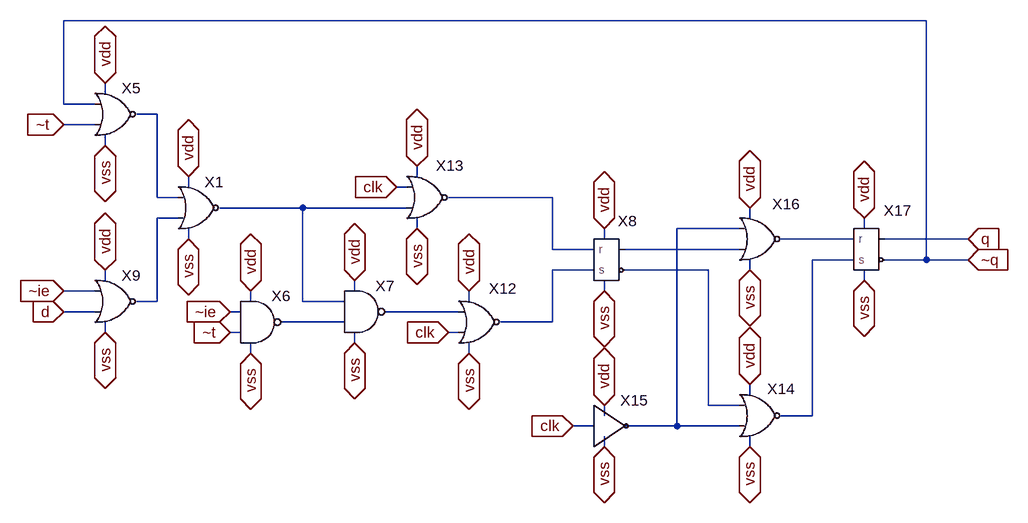
[diagram p0: schematic dt_flip_flop.asc]
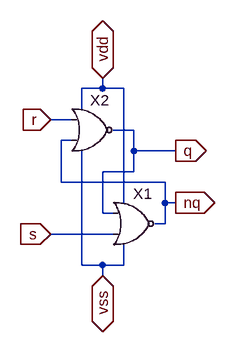
[diagram p1: sub-circuit sr_latch.asc]
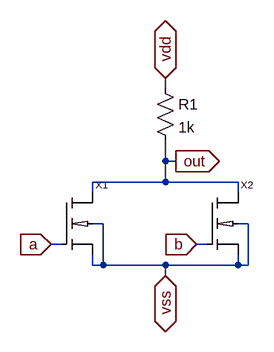
[diagram p2: sub-circuit nor.asc]
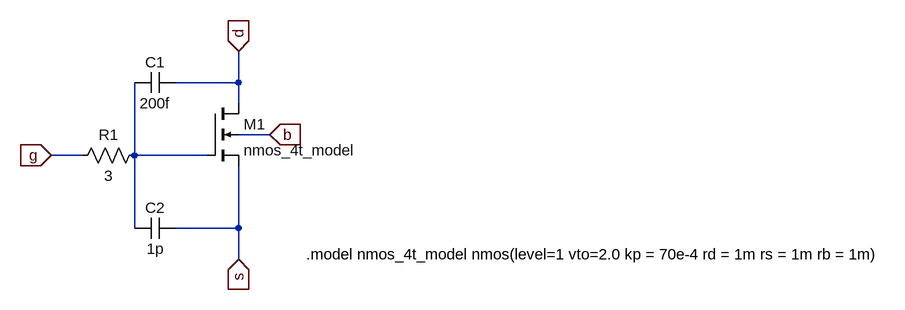
[diagram p3: sub-circuit nmos_4t.asc]
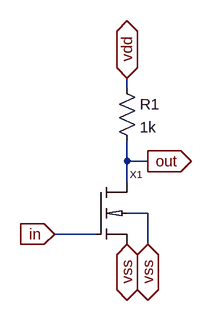
[diagram p4: sub-circuit not.asc]
dt_flip_flop.asc, the LTspice schematic file:
Version 4
SHEET 1 1928 1824
WIRE 1184 -16 -144 -16
WIRE -80 96 -80 80
WIRE -144 112 -144 -16
WIRE -96 112 -144 112
WIRE 0 128 -32 128
WIRE -96 144 -144 144
WIRE -80 176 -80 160
WIRE 400 224 400 208
WIRE 48 240 48 224
WIRE 384 240 368 240
WIRE 0 256 0 128
WIRE 32 256 0 256
WIRE 608 256 448 256
WIRE 224 272 96 272
WIRE 384 272 224 272
WIRE 32 288 0 288
WIRE 912 288 912 272
WIRE 400 304 400 288
WIRE 896 304 800 304
WIRE 1088 304 1088 288
WIRE 48 320 48 304
WIRE 688 320 688 304
WIRE 1072 320 960 320
WIRE 1248 320 1120 320
WIRE 608 336 608 256
WIRE 672 336 608 336
WIRE 896 336 720 336
WIRE 1072 352 1008 352
WIRE 1184 352 1184 -16
WIRE 1184 352 1120 352
WIRE 1248 352 1184 352
WIRE 672 368 608 368
WIRE 848 368 720 368
WIRE 912 368 912 352
WIRE -80 384 -80 368
WIRE 1088 384 1088 368
WIRE -96 400 -144 400
WIRE 304 400 304 384
WIRE 688 400 688 384
WIRE 0 416 0 288
WIRE 0 416 -32 416
WIRE 144 416 144 400
WIRE 224 416 224 272
WIRE 288 416 224 416
WIRE 480 416 480 400
WIRE -96 432 -144 432
WIRE 128 432 112 432
WIRE 464 432 352 432
WIRE 288 448 192 448
WIRE 608 448 608 368
WIRE 608 448 528 448
WIRE -80 464 -80 448
WIRE 128 464 112 464
WIRE 464 464 448 464
WIRE 304 480 304 464
WIRE 144 496 144 480
WIRE 480 496 480 480
WIRE 912 560 912 544
WIRE 848 576 848 368
WIRE 896 576 848 576
WIRE 688 592 688 576
WIRE 1008 592 1008 352
WIRE 1008 592 960 592
WIRE 672 608 640 608
WIRE 800 608 800 304
WIRE 800 608 720 608
WIRE 896 608 800 608
WIRE 688 640 688 624
WIRE 912 640 912 624
FLAG 112 432 ~ie
IOPIN 112 432 In
FLAG 112 464 ~t
IOPIN 112 464 In
FLAG 448 464 clk
IOPIN 448 464 In
FLAG 368 240 clk
IOPIN 368 240 In
FLAG 640 608 clk
IOPIN 640 608 In
FLAG 400 208 vdd
IOPIN 400 208 BiDir
FLAG 480 400 vdd
IOPIN 480 400 BiDir
FLAG 688 304 vdd
IOPIN 688 304 BiDir
FLAG 912 272 vdd
IOPIN 912 272 BiDir
FLAG 1088 288 vdd
IOPIN 1088 288 BiDir
FLAG 912 544 vdd
IOPIN 912 544 BiDir
FLAG 688 576 vdd
IOPIN 688 576 BiDir
FLAG 304 384 vdd
IOPIN 304 384 BiDir
FLAG 144 400 vdd
IOPIN 144 400 BiDir
FLAG 304 480 vss
IOPIN 304 480 BiDir
FLAG 144 496 vss
IOPIN 144 496 BiDir
FLAG 480 496 vss
IOPIN 480 496 BiDir
FLAG 688 400 vss
IOPIN 688 400 BiDir
FLAG 688 640 vss
IOPIN 688 640 BiDir
FLAG 912 640 vss
IOPIN 912 640 BiDir
FLAG 912 368 vss
IOPIN 912 368 BiDir
FLAG 1088 384 vss
IOPIN 1088 384 BiDir
FLAG 400 304 vss
IOPIN 400 304 BiDir
FLAG 1248 320 q
IOPIN 1248 320 In
FLAG 1248 352 ~q
IOPIN 1248 352 In
FLAG -144 432 d
IOPIN -144 432 In
FLAG -144 144 ~t
IOPIN -144 144 In
FLAG 48 224 vdd
IOPIN 48 224 BiDir
FLAG -80 80 vdd
IOPIN -80 80 BiDir
FLAG -80 368 vdd
IOPIN -80 368 BiDir
FLAG -80 176 vss
IOPIN -80 176 BiDir
FLAG -80 464 vss
IOPIN -80 464 BiDir
FLAG 48 320 vss
IOPIN 48 320 BiDir
FLAG -144 400 ~ie
IOPIN -144 400 In
SYMBOL sr_latch 704 352 R0
WINDOW 0 20 -44 Bottom 2
SYMATTR InstName X8
SYMBOL nor 496 384 R0
WINDOW 0 15 12 Left 2
SYMATTR InstName X12
SYMBOL nor 416 192 R0
WINDOW 0 13 15 Left 2
SYMATTR InstName X13
SYMBOL not 672 608 R0
WINDOW 0 62 -24 Bottom 2
SYMATTR InstName X15
SYMBOL nor 928 528 R0
WINDOW 0 11 23 Left 2
SYMATTR InstName X14
SYMBOL nor 928 256 R0
WINDOW 0 19 10 Left 2
SYMATTR InstName X16
SYMBOL sr_latch 1104 336 R0
WINDOW 0 36 -44 Bottom 2
SYMATTR InstName X17
SYMBOL nor 64 208 R0
WINDOW 0 9 24 Left 2
SYMATTR InstName X1
SYMBOL nor -64 64 R0
WINDOW 0 9 24 Left 2
SYMATTR InstName X5
SYMBOL nor -64 352 R0
WINDOW 0 9 24 Left 2
SYMATTR InstName X9
SYMBOL nand 160 384 R0
SYMATTR InstName X6
SYMBOL nand 320 368 R0
SYMATTR InstName X7

sr_latch.asc, the sub-circuit schematic file:
Version 4
SHEET 1 880 680
WIRE 208 0 208 -16
WIRE 208 0 176 0
WIRE 240 0 208 0
WIRE 176 32 176 0
WIRE 160 48 128 48
WIRE 256 64 224 64
WIRE 160 80 144 80
WIRE 256 96 256 64
WIRE 320 96 256 96
WIRE 256 128 256 96
WIRE 256 128 208 128
WIRE 144 144 144 80
WIRE 304 144 144 144
WIRE 240 176 240 0
WIRE 304 176 304 144
WIRE 320 176 304 176
WIRE 208 192 208 128
WIRE 224 192 208 192
WIRE 304 208 304 176
WIRE 304 208 288 208
WIRE 224 224 128 224
WIRE 176 272 176 96
WIRE 208 272 176 272
WIRE 240 272 240 240
WIRE 240 272 208 272
WIRE 208 288 208 272
FLAG 128 224 s
IOPIN 128 224 In
FLAG 128 48 r
IOPIN 128 48 In
FLAG 320 96 q
IOPIN 320 96 Out
FLAG 320 176 nq
IOPIN 320 176 Out
FLAG 208 288 vss
IOPIN 208 288 BiDir
FLAG 208 -16 vdd
IOPIN 208 -16 BiDir
SYMBOL nor 256 144 R0
WINDOW 0 -1 18 Left 2
SYMATTR InstName X1
SYMBOL nor 192 0 R0
WINDOW 0 -3 18 Left 2
SYMATTR InstName X2

nor.asc, the sub-circuit schematic file:
Version 4
SHEET 1 880 680
WIRE 240 48 240 32
WIRE 240 160 240 128
WIRE 256 160 240 160
WIRE 240 192 240 160
WIRE 240 192 128 192
WIRE 352 192 240 192
WIRE 128 208 128 192
WIRE 352 208 352 192
WIRE 144 256 128 256
WIRE 368 256 352 256
WIRE 80 288 64 288
WIRE 304 288 288 288
WIRE 128 320 128 304
WIRE 144 320 144 256
WIRE 144 320 128 320
WIRE 240 320 144 320
WIRE 352 320 352 304
WIRE 352 320 240 320
WIRE 368 320 368 256
WIRE 368 320 352 320
WIRE 240 336 240 320
FLAG 240 32 vdd
IOPIN 240 32 BiDir
FLAG 240 336 vss
IOPIN 240 336 BiDir
FLAG 256 160 out
IOPIN 256 160 Out
FLAG 288 288 b
IOPIN 288 288 In
FLAG 64 288 a
IOPIN 64 288 In
SYMBOL res 224 32 R0
SYMATTR InstName R1
SYMATTR Value 1k
SYMBOL nmos_4t 80 208 R0
SYMATTR InstName X1
SYMBOL nmos_4t 304 208 R0
SYMATTR InstName X2

nmos_4t.asc, the sub-circuit schematic file:
Version 4
SHEET 1 880 680
WIRE -288 -224 -288 -272
WIRE -288 -224 -384 -224
WIRE -288 -192 -288 -224
WIRE -240 -144 -288 -144
WIRE -528 -112 -576 -112
WIRE -448 -112 -448 -224
WIRE -336 -112 -448 -112
WIRE -448 0 -448 -112
WIRE -288 0 -288 -96
WIRE -288 0 -384 0
WIRE -288 48 -288 0
FLAG -576 -112 g
IOPIN -576 -112 In
FLAG -288 -272 d
IOPIN -288 -272 In
FLAG -288 48 s
IOPIN -288 48 In
FLAG -240 -144 b
IOPIN -240 -144 In
SYMBOL nmos4 -336 -192 R0
SYMATTR InstName M1
SYMATTR Value nmos_4t_model
SYMBOL cap -384 -240 R90
WINDOW 0 0 32 VBottom 2
WINDOW 3 32 32 VTop 2
SYMATTR InstName C1
SYMATTR Value 200f
SYMBOL cap -384 -16 R90
WINDOW 0 0 32 VBottom 2
WINDOW 3 32 32 VTop 2
SYMATTR InstName C2
SYMATTR Value 1p
SYMBOL res -432 -128 R90
WINDOW 0 0 56 VBottom 2
WINDOW 3 32 56 VTop 2
SYMATTR InstName R1
SYMATTR Value 3
TEXT -184 40 Left 2 !.model nmos_4t_model nmos(level=1 vto=2.0 kp = 70e-4 rd = 1m rs = 1m rb = 1m)

not.asc, the sub-circuit schematic file:
Version 4
SHEET 1 880 680
WIRE 176 -96 176 -112
WIRE 176 16 176 -16
WIRE 208 16 176 16
WIRE 176 48 176 16
WIRE 208 96 176 96
WIRE 128 128 64 128
WIRE 208 144 208 96
FLAG 64 128 in
IOPIN 64 128 In
FLAG 176 144 vss
IOPIN 176 144 BiDir
FLAG 176 -112 vdd
IOPIN 176 -112 BiDir
FLAG 208 16 out
IOPIN 208 16 Out
FLAG 208 144 vss
IOPIN 208 144 BiDir
SYMBOL res 160 -112 R0
SYMATTR InstName R1
SYMATTR Value 1k
SYMBOL nmos_4t 128 48 R0
SYMATTR InstName X1

The netlist it stands for:
* dt_flip_flop.asc
XX8 N002 N009 N010 N007 vdd vss sr_latch
XX12 N011 clk vdd vss N009 nor
XX13 clk N003 vdd vss N002 nor
XX15 clk N005 vss vdd not
XX14 N010 N005 vdd vss N008 nor
XX16 N005 N007 vdd vss N006 nor
XX17 N006 N008 ~q q vdd vss sr_latch
XX1 N001 N004 vdd vss N003 nor
XX5 ~q ~t vdd vss N001 nor
XX9 ~ie d vdd vss N004 nor
XX6 ~ie ~t vdd vss N012 nand  ; pins a b vdd vss out
XX7 N003 N012 vdd vss N011 nand  ; pins a b vdd vss out

* block symbol definitions
.subckt sr_latch r s nq q vdd vss
XX1 q s vdd vss nq nor
XX2 r nq vdd vss q nor
.ends sr_latch

.subckt nor a b vdd vss out
R1 vdd out 1k
XX1 out a vss vss nmos_4t
XX2 out b vss vss nmos_4t
.ends nor

.subckt nmos_4t D G S B
M1 d N001 s b nmos_4t_model
C1 d N001 200f
C2 s N001 1p
R1 N001 g 3
.model nmos_4t_model nmos(level=1 vto=2.0 kp = 70e-4 rd = 1m rs = 1m rb = 1m)
.ends nmos_4t

.subckt not in out vss vdd
R1 vdd out 1k
XX1 out in vss vss nmos_4t
.ends not

.model NMOS NMOS
.model PMOS PMOS
.lib standard.mos
.backanno
.end